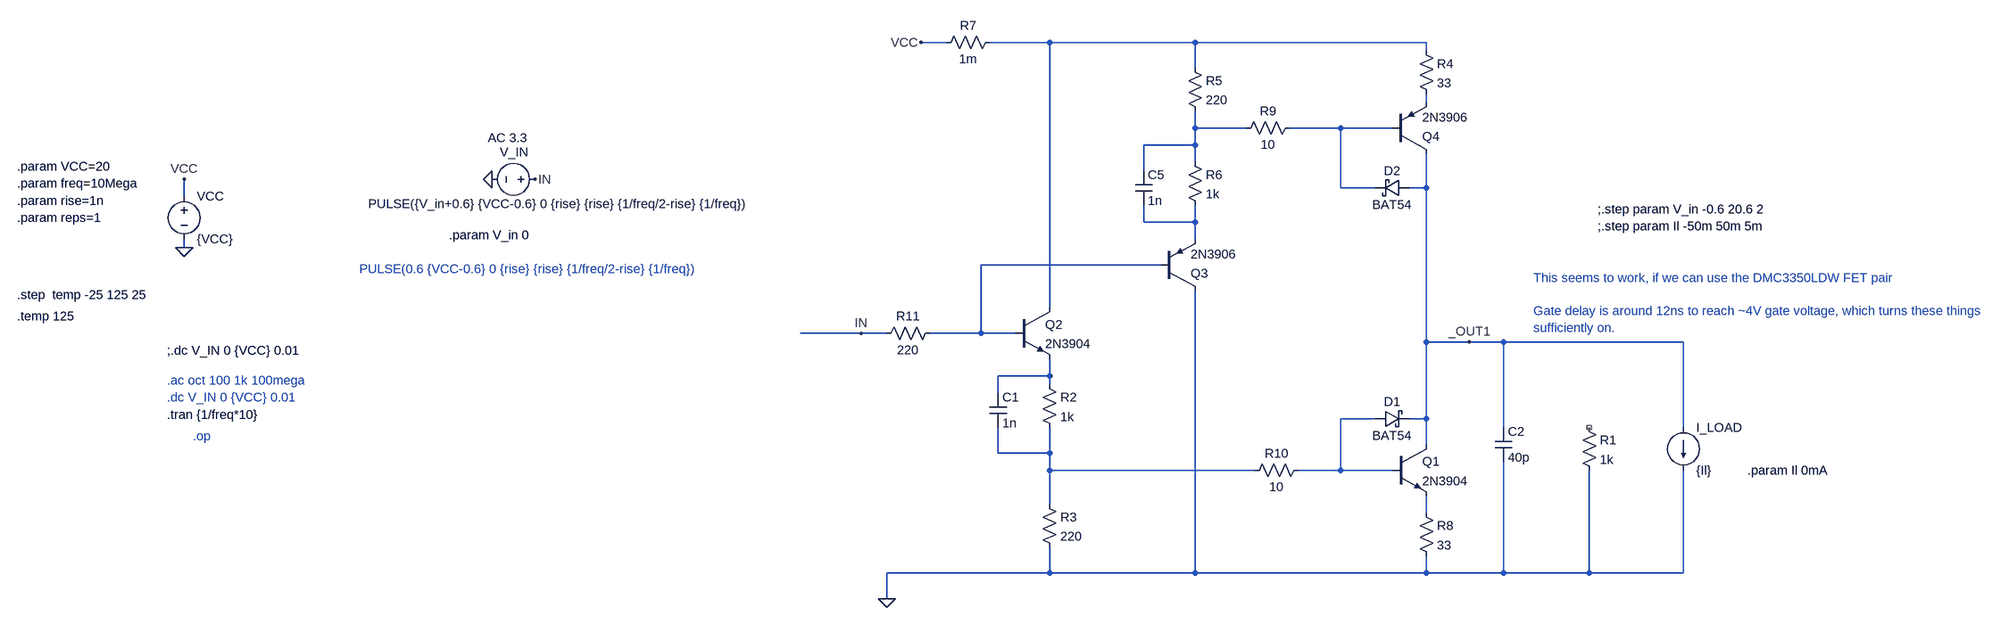
[diagram p0: schematic fast_inverter_hv.asc]
fast_inverter_hv.asc, the LTspice schematic file:
Version 4.1
SHEET 1 14868 10612
WIRE 1552 624 1504 624
WIRE 1744 624 1632 624
WIRE 2016 624 1744 624
WIRE 2448 624 2016 624
WIRE 2448 640 2448 624
WIRE 2016 672 2016 624
WIRE 2448 736 2448 720
WIRE 2016 784 2016 752
WIRE 2112 784 2016 784
WIRE 2288 784 2192 784
WIRE 2384 784 2288 784
WIRE 2016 816 2016 784
WIRE 2016 816 1920 816
WIRE 2016 848 2016 816
WIRE 1920 864 1920 816
WIRE 2288 896 2288 784
WIRE 2352 896 2288 896
WIRE 2448 896 2448 832
WIRE 2448 896 2416 896
WIRE -752 912 -752 880
WIRE 1920 960 1920 928
WIRE 2016 960 2016 928
WIRE 2016 960 1920 960
WIRE 2016 992 2016 960
WIRE -752 1008 -752 992
WIRE 1952 1040 1616 1040
WIRE 1744 1120 1744 624
WIRE 1392 1168 1200 1168
WIRE 1440 1168 1392 1168
WIRE 1616 1168 1616 1040
WIRE 1616 1168 1520 1168
WIRE 1680 1168 1616 1168
WIRE 2448 1184 2448 896
WIRE 2528 1184 2448 1184
WIRE 2592 1184 2528 1184
WIRE 2928 1184 2592 1184
WIRE 1744 1248 1744 1216
WIRE 1744 1248 1648 1248
WIRE 1744 1264 1744 1248
WIRE 1648 1280 1648 1248
WIRE 2352 1328 2288 1328
WIRE 2448 1328 2448 1184
WIRE 2448 1328 2416 1328
WIRE 2592 1344 2592 1184
WIRE 2928 1344 2928 1184
WIRE 2448 1376 2448 1328
WIRE 1648 1392 1648 1344
WIRE 1744 1392 1744 1344
WIRE 1744 1392 1648 1392
WIRE 1744 1424 1744 1392
WIRE 2128 1424 1744 1424
WIRE 2288 1424 2288 1328
WIRE 2288 1424 2208 1424
WIRE 2384 1424 2288 1424
WIRE 1744 1488 1744 1424
WIRE 2448 1504 2448 1472
WIRE 1744 1616 1744 1568
WIRE 1744 1616 1440 1616
WIRE 2016 1616 2016 1088
WIRE 2016 1616 1744 1616
WIRE 2448 1616 2448 1584
WIRE 2448 1616 2016 1616
WIRE 2592 1616 2592 1408
WIRE 2592 1616 2448 1616
WIRE 2752 1616 2752 1424
WIRE 2752 1616 2592 1616
WIRE 2928 1616 2928 1424
WIRE 2928 1616 2752 1616
WIRE 1440 1664 1440 1616
FLAG -752 1008 0
FLAG 128 880 IN
FLAG -752 880 VCC
FLAG 48 880 0
FLAG 1440 1664 0
FLAG 1504 624 VCC
FLAG 2528 1184 _OUT1
FLAG 1392 1168 IN
SYMBOL voltage -752 896 R0
WINDOW 123 0 0 Left 0
WINDOW 39 0 0 Left 0
SYMATTR InstName VCC
SYMATTR Value {VCC}
SYMBOL voltage 144 880 R90
WINDOW 123 -77 30 VRight 2
WINDOW 39 0 0 Left 0
WINDOW 0 -51 28 VRight 2
WINDOW 3 46 -379 VRight 2
SYMATTR Value2 AC 3.3
SYMATTR InstName V_IN
SYMATTR Value PULSE({V_in+0.6} {VCC-0.6} 0 {rise} {rise} {1/freq/2-rise} {1/freq})
SYMBOL npn 2384 1376 R0
SYMATTR InstName Q1
SYMATTR Value 2N3904
SYMBOL schottky 2352 1344 R270
WINDOW 0 32 32 VTop 2
WINDOW 3 0 32 VBottom 2
SYMATTR InstName D1
SYMATTR Value BAT54
SYMATTR Description Diode
SYMATTR Type diode
SYMBOL npn 1680 1120 R0
SYMATTR InstName Q2
SYMATTR Value 2N3904
SYMBOL res 1728 1248 R0
SYMATTR InstName R2
SYMATTR Value 1k
SYMBOL res 1728 1472 R0
SYMATTR InstName R3
SYMATTR Value 220
SYMBOL cap 1632 1280 R0
SYMATTR InstName C1
SYMATTR Value 1n
SYMBOL cap 2576 1344 R0
SYMATTR InstName C2
SYMATTR Value 40p
SYMBOL pnp 1952 1088 M180
SYMATTR InstName Q3
SYMATTR Value 2N3906
SYMBOL res 2000 656 R0
SYMATTR InstName R5
SYMATTR Value 220
SYMBOL res 2000 832 R0
SYMATTR InstName R6
SYMATTR Value 1k
SYMBOL cap 1904 864 R0
SYMATTR InstName C5
SYMATTR Value 1n
SYMBOL schottky 2416 880 R90
WINDOW 0 0 32 VBottom 2
WINDOW 3 32 32 VTop 2
SYMATTR InstName D2
SYMATTR Value BAT54
SYMATTR Description Diode
SYMATTR Type diode
SYMBOL pnp 2384 832 M180
SYMATTR InstName Q4
SYMATTR Value 2N3906
SYMBOL res 1536 640 R270
WINDOW 0 32 56 VTop 2
WINDOW 3 0 56 VBottom 2
SYMATTR InstName R7
SYMATTR Value 1m
SYMBOL res 2736 1328 R0
SYMATTR InstName R1
SYMATTR Value 1k
SYMBOL current 2928 1344 R0
WINDOW 123 0 0 Left 0
WINDOW 39 0 0 Left 0
SYMATTR InstName I_LOAD
SYMATTR Value {Il}
SYMBOL res 2432 624 R0
SYMATTR InstName R4
SYMATTR Value 33
SYMBOL res 2432 1488 R0
SYMATTR InstName R8
SYMATTR Value 33
SYMBOL res 2208 768 R90
WINDOW 0 0 56 VBottom 2
WINDOW 3 32 56 VTop 2
SYMATTR InstName R9
SYMATTR Value 10
SYMBOL res 2224 1408 R90
WINDOW 0 0 56 VBottom 2
WINDOW 3 32 56 VTop 2
SYMATTR InstName R10
SYMATTR Value 10
SYMBOL res 1424 1184 R270
WINDOW 0 32 56 VTop 2
WINDOW 3 0 56 VBottom 2
SYMATTR InstName R11
SYMATTR Value 220
TEXT -784 1200 Left 2 !;.dc V_IN 0 {VCC} 0.01
TEXT -784 1256 Left 2 ;.ac oct 100 1k 100mega
TEXT -784 1288 Left 2 ;.dc V_IN 0 {VCC} 0.01
TEXT -1064 856 Left 2 !.param VCC=20
TEXT -1064 888 Left 2 !.param freq=10Mega
TEXT -1064 920 Left 2 !.param rise=1n
TEXT -1064 952 Left 2 !.param reps=1
TEXT -1064 1096 Left 2 !.step  temp -25 125 25
TEXT -1064 1136 Left 2 !.temp 125
TEXT -736 1360 Left 2 ;.op
TEXT 2768 968 Left 2 !;.step param Il -50m 50m 5m
TEXT -200 1048 Left 2 ;PULSE(0.6 {VCC-0.6} 0 {rise} {rise} {1/freq/2-rise} {1/freq})
TEXT 2768 936 Left 2 !;.step param V_in -0.6 20.6 2
TEXT 3048 1424 Left 2 !.param Il 0mA
TEXT -32 984 Left 2 !.param V_in 0
TEXT -784 1320 Left 2 !.tran {1/freq*10}
TEXT 2648 1064 Left 2 ;This seems to work, if we can use the DMC3350LDW FET pair\n \nGate delay is around 12ns to reach ~4V gate voltage, which turns these things\nsufficiently on.

The netlist it stands for:
* fast_inverter_hv.asc
VCC VCC 0 {VCC}
V_IN IN 0 PULSE({V_in+0.6} {VCC-0.6} 0 {rise} {rise} {1/freq/2-rise} {1/freq}) AC 3.3
Q1 _OUT1 N008 N010 0 2N3904
D1 N008 _OUT1 BAT54
Q2 N001 N006 N007 0 2N3904
R2 N007 N009 1k
R3 N009 0 220
C1 N007 N009 1n
C2 _OUT1 0 40p
Q3 0 N006 N005 0 2N3906
R5 N001 N003 220
R6 N003 N005 1k
C5 N003 N005 1n
D2 _OUT1 N004 BAT54
Q4 _OUT1 N004 N002 0 2N3906
R7 VCC N001 1m
R1 NC_01 0 1k
I_LOAD _OUT1 0 {Il}
R4 N001 N002 33
R8 N010 0 33
R9 N004 N003 10
R10 N008 N009 10
R11 IN N006 220
.model D D
.lib standard.dio
.model NPN NPN
.model PNP PNP
.lib standard.bjt
;.dc V_IN 0 {VCC} 0.01
* .ac oct 100 1k 100mega
* .dc V_IN 0 {VCC} 0.01
.param VCC=20
.param freq=10Mega
.param rise=1n
.param reps=1
.step  temp -25 125 25
.temp 125
* .op
;.step param Il -50m 50m 5m
* PULSE(0.6 {VCC-0.6} 0 {rise} {rise} {1/freq/2-rise} {1/freq})
;.step param V_in -0.6 20.6 2
.param Il 0mA
.param V_in 0
.tran {1/freq*10}
* This seems to work, if we can use the DMC3350LDW FET pair
* Gate delay is around 12ns to reach ~4V gate voltage, which turns these things
* sufficiently on.
.backanno
.end